# EAGLE board CFT-PB2-smd-revB (EAGLE 5.11), part 1 of 2
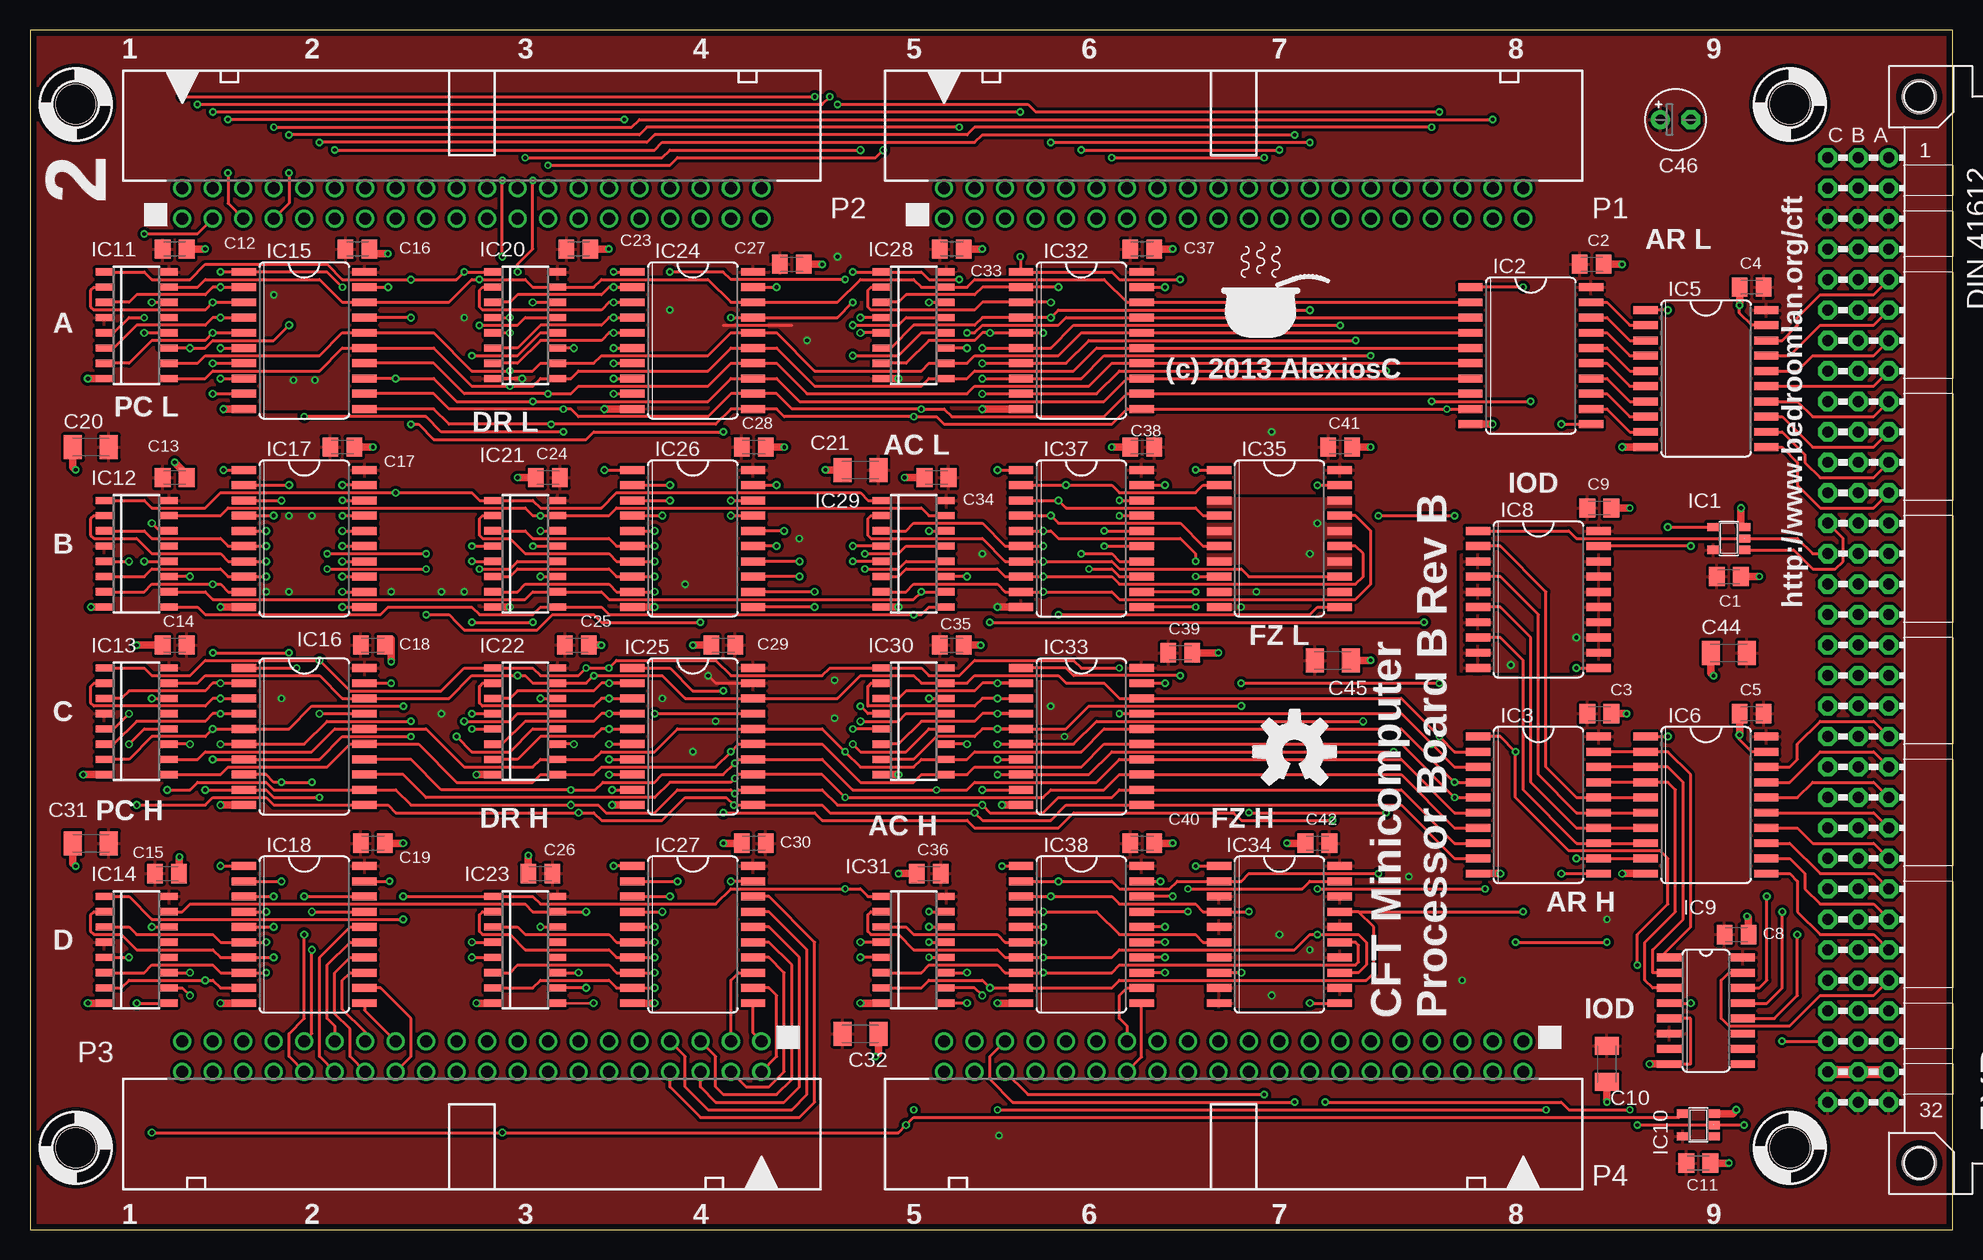
[diagram p6: board, top side]
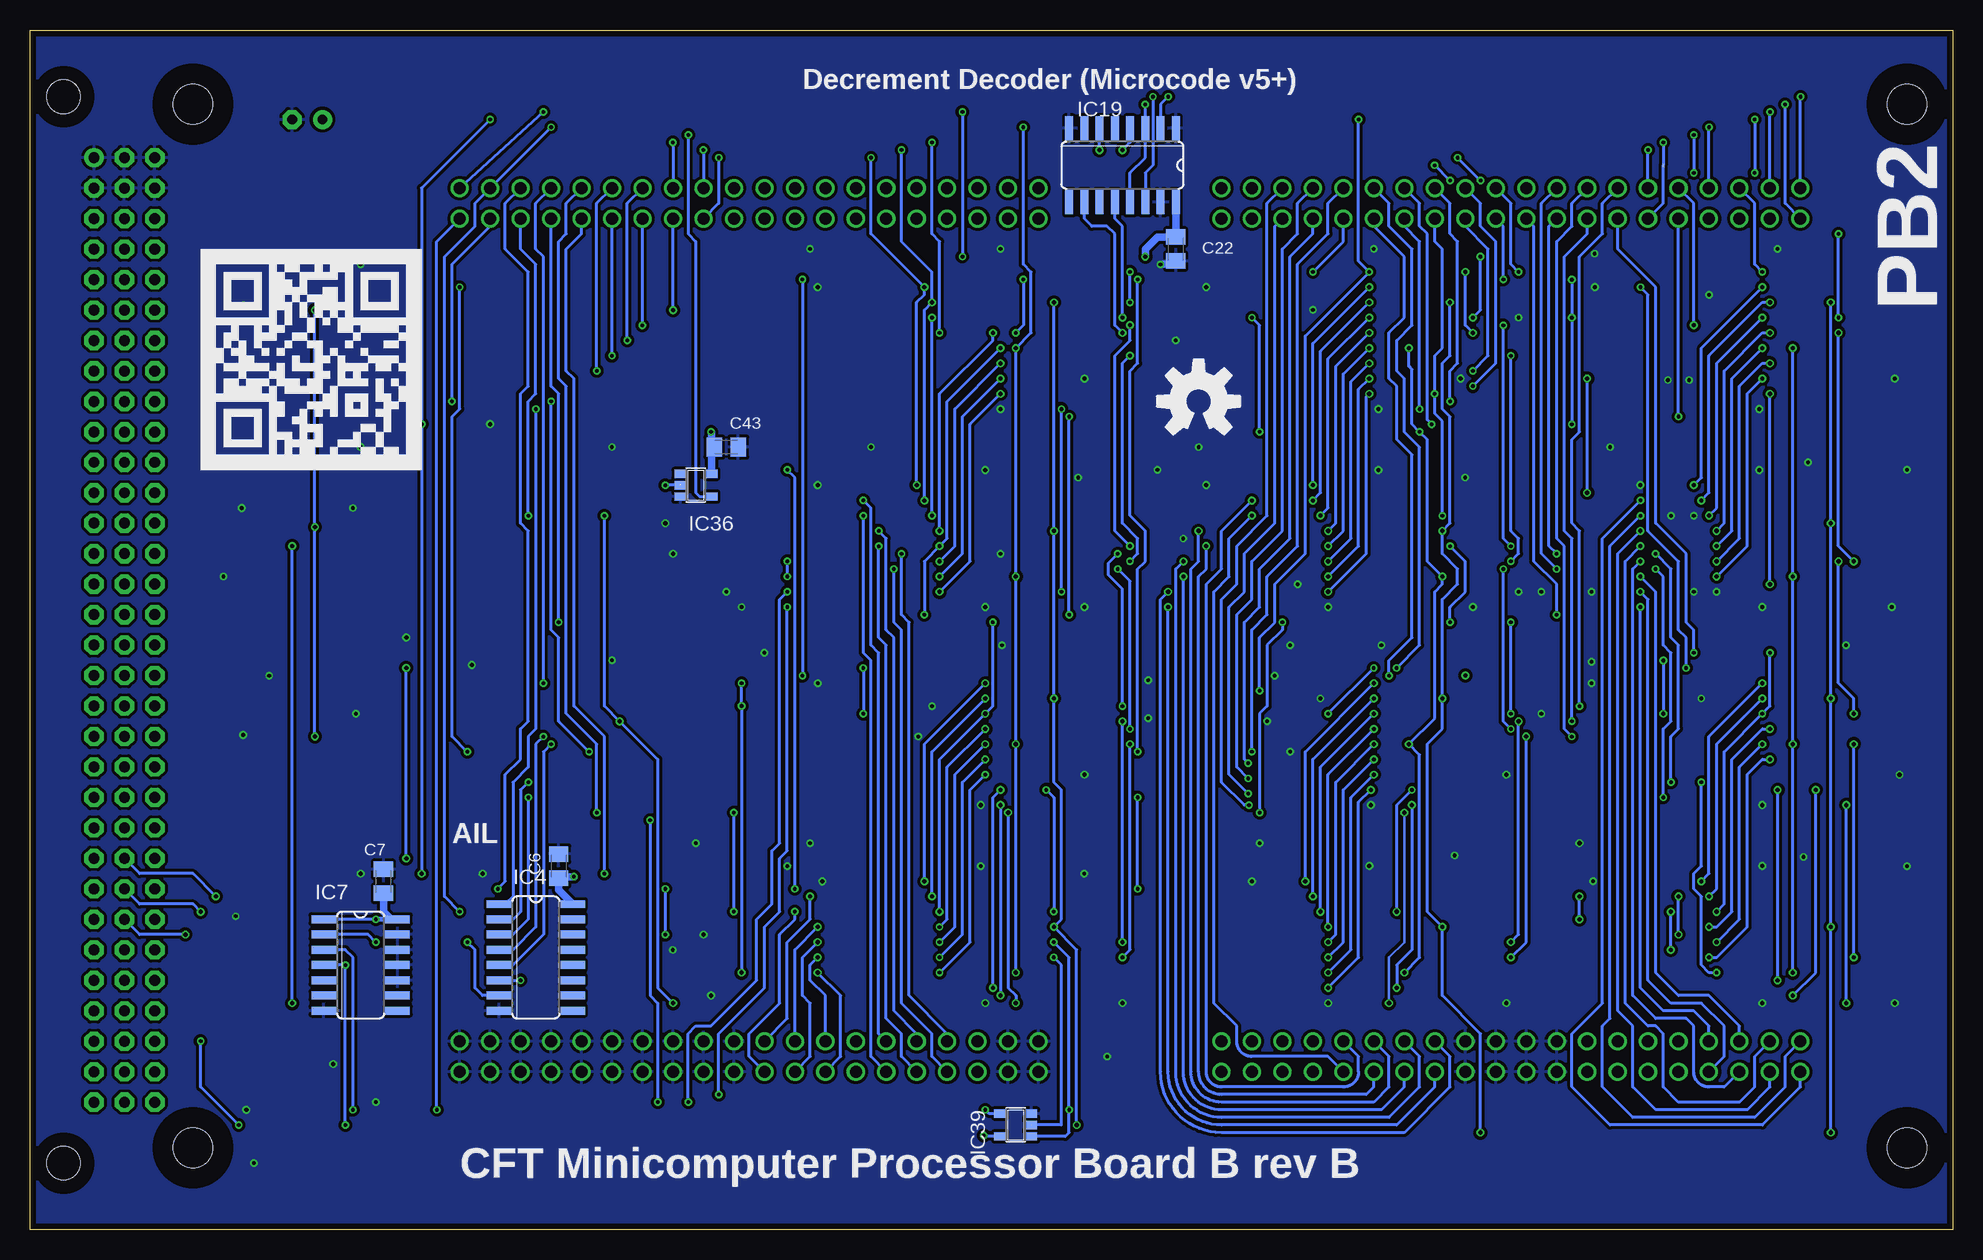
[diagram p7: board, bottom side, seen from below]

Size 160.27 x 100.03 mm. Coordinates in mm from the lower left corner, seen from the top.
Copper layers (1*16): Top 0.035mm / dielectric 1.5mm / Bottom 0.035mm
Design rules "smart-prototyping *": minimum track width 7mil, minimum drill 12mil, track to track 7mil, track to pad 7mil, pad to pad 7mil, via to via 7mil, smd to smd 0mil, copper to edge 20mil, drill to drill 10mil, minimum pad ring 10mil, minimum via ring 6mil, stop-mask expansion 2mil, vias tented up to drill 25mil, thermal gap 10mil
Net classes: 0 default: width 0.152 mm, clearance 0.152 mm; 1 low power: width 0.305 mm, clearance 0.152 mm; 2 LED power: width 0.406 mm, clearance 0.254 mm

## Footprints (pad centres in the part's own frame; a part is rotated, then mirrored left to right if it is on the bottom)
C0805K = smd 1.3 x 1.6: 1 -1,0; 2 1,0
C1206K = smd 1.5 x 2: 1 -1.5,0; 2 1.5,0
E2,5-5 = drill 0.813 pad 1.6 round: + -1.27,0 | drill 0.813 pad 1.6 octagon: - 1.27,0
VG96K = drill 0.914 pad 1.6 round: A1 154.94,39.37 | drill 0.914 pad 1.6 octagon: A2 154.94,36.83; A3 154.94,34.29; A4 154.94,31.75; A5 154.94,29.21; A6 154.94,26.67; A7 154.94,24.13; A8 154.94,21.59; A9 154.94,19.05; A10 154.94,16.51; A11 154.94,13.97; A12 154.94,11.43; A13 154.94,8.89; A14 154.94,6.35; A15 154.94,3.81; A16 154.94,1.27; A17 154.94,-1.27; A18 154.94,-3.81; A19 154.94,-6.35; A20 154.94,-8.89; A21 154.94,-11.43; A22 154.94,-13.97; A23 154.94,-16.51; A24 154.94,-19.05; A25 154.94,-21.59; A26 154.94,-24.13; A27 154.94,-26.67; A28 154.94,-29.21; A29 154.94,-31.75; A30 154.94,-34.29; A31 154.94,-36.83; A32 154.94,-39.37; B1 152.4,39.37; B2 152.4,36.83; B3 152.4,34.29; B4 152.4,31.75; B5 152.4,29.21; B6 152.4,26.67; B7 152.4,24.13; B8 152.4,21.59; B9 152.4,19.05; B10 152.4,16.51; B11 152.4,13.97; B12 152.4,11.43; B13 152.4,8.89; B14 152.4,6.35; B15 152.4,3.81; B16 152.4,1.27; B17 152.4,-1.27; B18 152.4,-3.81; B19 152.4,-6.35; B20 152.4,-8.89; B21 152.4,-11.43; B22 152.4,-13.97; B23 152.4,-16.51; B24 152.4,-19.05; B25 152.4,-21.59; B26 152.4,-24.13; B27 152.4,-26.67; B28 152.4,-29.21; B29 152.4,-31.75; B30 152.4,-34.29; B31 152.4,-36.83; B32 152.4,-39.37; C1 149.86,39.37; C2 149.86,36.83; C3 149.86,34.29; C4 149.86,31.75; C5 149.86,29.21; C6 149.86,26.67; C7 149.86,24.13; C8 149.86,21.59; C9 149.86,19.05; C10 149.86,16.51; C11 149.86,13.97; C12 149.86,11.43; C13 149.86,8.89; C14 149.86,6.35; C15 149.86,3.81; C16 149.86,1.27; C17 149.86,-1.27; C18 149.86,-3.81; C19 149.86,-6.35; C20 149.86,-8.89; C21 149.86,-11.43; C22 149.86,-13.97; C23 149.86,-16.51; C24 149.86,-19.05; C25 149.86,-21.59; C26 149.86,-24.13; C27 149.86,-26.67; C28 149.86,-29.21; C29 149.86,-31.75; C30 149.86,-34.29; C31 149.86,-36.83; C32 149.86,-39.37 | hole 2.794: 157.48,44.45; 157.48,-44.45
SOT23-5 = smd 0.69 x 0.99: 1 -0.95,-1.29; 2 0,-1.29; 3 0.95,-1.29; 4 0.95,1.3; 5 -0.95,1.3
SO20W = smd 0.66 x 2.032: 1 -5.715,-5.029; 2 -4.445,-5.029; 3 -3.175,-5.029; 4 -1.905,-5.029; 5 -0.635,-5.029; 6 0.635,-5.029; 7 1.905,-5.029; 8 3.175,-5.029; 9 4.445,-5.029; 10 5.715,-5.029; 11 5.715,5.029; 12 4.445,5.029; 13 3.175,5.029; 14 1.905,5.029; 15 0.635,5.029; 16 -0.635,5.029; 17 -1.905,5.029; 18 -3.175,5.029; 19 -4.445,5.029; 20 -5.715,5.029
SO16 = smd 0.66 x 2.032: 1 -4.445,-3.073; 2 -3.175,-3.073; 3 -1.905,-3.073; 4 -0.635,-3.073; 5 0.635,-3.073; 6 1.905,-3.073; 7 3.175,-3.073; 8 4.445,-3.073; 9 4.445,3.073; 10 3.175,3.073; 11 1.905,3.073; 12 0.635,3.073; 13 -0.635,3.073; 14 -1.905,3.073; 15 -3.175,3.073; 16 -4.445,3.073
SO14 = smd 0.66 x 2.032: 1 -3.81,-3.073; 2 -2.54,-3.073; 3 -1.27,-3.073; 4 0,-3.073; 5 1.27,-3.073; 6 2.54,-3.073; 7 3.81,-3.073; 8 3.81,3.073; 9 2.54,3.073; 10 1.27,3.073; 11 0,3.073; 12 -1.27,3.073; 13 -2.54,3.073; 14 -3.81,3.073
SO16D = smd 0.6 x 1.4: 1 -4.445,-2.715; 2 -3.175,-2.715; 3 -1.905,-2.715; 4 -0.635,-2.715; 5 0.635,-2.715; 6 1.905,-2.715; 7 3.175,-2.715; 8 4.445,-2.715; 9 4.445,2.715; 10 3.175,2.715; 11 1.905,2.715; 12 0.635,2.715; 13 -0.635,2.715; 14 -1.905,2.715; 15 -3.175,2.715; 16 -4.445,2.715
PAK100/2500-5-40 = drill 1 pad 1.422 round: 1 -24.13,-1.27; 2 -24.13,1.27; 3 -21.59,-1.27; 4 -21.59,1.27; 5 -19.05,-1.27; 6 -19.05,1.27; 7 -16.51,-1.27; 8 -16.51,1.27; 9 -13.97,-1.27; 10 -13.97,1.27; 11 -11.43,-1.27; 12 -11.43,1.27; 13 -8.89,-1.27; 14 -8.89,1.27; 15 -6.35,-1.27; 16 -6.35,1.27; 17 -3.81,-1.27; 18 -3.81,1.27; 19 -1.27,-1.27; 20 -1.27,1.27; 21 1.27,-1.27; 22 1.27,1.27; 23 3.81,-1.27; 24 3.81,1.27; 25 6.35,-1.27; 26 6.35,1.27; 27 8.89,-1.27; 28 8.89,1.27; 29 11.43,-1.27; 30 11.43,1.27; 31 13.97,-1.27; 32 13.97,1.27; 33 16.51,-1.27; 34 16.51,1.27; 35 19.05,-1.27; 36 19.05,1.27; 37 21.59,-1.27; 38 21.59,1.27; 39 24.13,-1.27; 40 24.13,1.27
STANDOFF_28_60 = hole 3.302: 0,0
SIGNAL-RENAME = smd 0.305 x 0.152: P$1 0,0; P$2 0,0

## Placement (x,y rotation side)
$4_37_$  SIGNATURESILK  [SIGNATURE]  99.69,74.14 0 top
$4_39_$  OSHW-LOGOL  [OSHW-LOGO-L]  105.41,39.85 0 top
$4_39_$1  OSHW-LOGOL  [OSHW-LOGO-L]  62.87,69.06 0 bottom
$4_40_$  QRCODE-CFT  [CFT-QRCODE]  146.05,63.35 0 bottom
C1  0.1uF  [C0805K]  141.6,54.46 180 top
C2  0.1uF  [C0805K]  130.18,80.49 180 top
C3  0.1uF  [C0805K]  130.81,43.03 180 top
C4  0.1uF  [C0805K]  143.51,78.59 0 top
C5  0.1uF  [C0805K]  143.51,43.03 0 top
C6  0.1uF  [C0805K]  116.2,30.33 270 bottom
C7  0.1uF  [C0805K]  130.81,29.06 270 bottom
C8  0.1uF  [C0805K]  142.24,24.61 180 top
C9  0.1uF  [C0805K]  130.81,60.17 180 top
C10  1uF  [C1206K]  131.44,13.82 90 top
C11  0.1uF  [C0805K]  139.06,5.56 180 top
C12  0.1uF  [C0805K]  12.06,81.76 180 top
C13  0.1uF  [C0805K]  12.06,62.71 180 top
C14  0.1uF  [C0805K]  12.06,48.74 0 top
C15  0.1uF  [C0805K]  11.43,29.69 180 top
C16  0.1uF  [C0805K]  27.3,81.76 180 top
C17  0.1uF  [C0805K]  26.04,65.25 180 top
C18  0.1uF  [C0805K]  28.57,48.74 180 top
C19  0.1uF  [C0805K]  28.57,32.23 0 top
C20  1uF  [C1206K]  5.08,65.25 0 top
C21  1uF  [C1206K]  69.22,63.35 0 top
C22  0.1uF  [C0805K]  64.77,81.76 90 bottom
C23  0.1uF  [C0805K]  45.72,81.76 180 top
C24  0.1uF  [C0805K]  43.18,62.71 0 top
C25  0.1uF  [C0805K]  45.59,48.74 180 top
C26  0.1uF  [C0805K]  42.55,29.69 0 top
C27  0.1uF  [C0805K]  63.5,80.49 180 top
C28  0.1uF  [C0805K]  60.33,65.25 180 top
C29  0.1uF  [C0805K]  57.78,48.74 0 top
C30  0.1uF  [C0805K]  60.33,32.23 180 top
C31  1uF  [C1206K]  5.08,32.23 0 top
C32  1uF  [C1206K]  69.22,16.36 180 top
C33  0.1uF  [C0805K]  76.83,81.76 180 top
C34  0.1uF  [C0805K]  75.56,62.71 0 top
C35  0.1uF  [C0805K]  76.83,48.74 180 top
C36  0.1uF  [C0805K]  74.93,29.69 0 top
C37  0.1uF  [C0805K]  92.71,81.76 180 top
C38  0.1uF  [C0805K]  92.71,65.25 0 top
C39  0.1uF  [C0805K]  95.89,48.11 180 top
C40  0.1uF  [C0805K]  92.71,32.23 180 top
C41  0.1uF  [C0805K]  109.22,65.25 180 top
C42  0.1uF  [C0805K]  107.31,32.23 0 top
C43  0.1uF  [C0805K]  102.23,65.25 0 bottom
C44  1uF  [C1206K]  141.6,48.11 0 top
C45  1uF  [C1206K]  108.58,47.47 180 top
C46  1uF  [E2,5-5]  137.16,92.56 0 top
EXP  [VG96K]  0,50.01 0 top
IC1  74AHC1G08DBV  [SOT23-5]  141.6,57.63 90 top
IC2  74HC574D  [SO20W]  125.09,72.87 270 top
IC3  74HC574D  [SO20W]  125.73,35.41 270 top
IC4  74HC138D  [SO16]  118.11,22.71 270 bottom
IC5  74HC541DW  [SO20W]  139.7,70.97 270 top
IC6  74HC541DW  [SO20W]  139.7,35.41 270 top
IC7  74HC74D  [SO14]  132.72,22.07 270 bottom
IC8  74HC688DW  [SO20W]  125.73,52.55 270 top
IC9  74HC138D  [SO16]  139.7,18.26 270 top
IC10  74AHC1G04DBV  [SOT23-5]  139.06,8.74 90 top
IC11  74HC193D  [SO16D]  8.89,75.41 270 top
IC12  74HC193D  [SO16D]  8.89,56.36 270 top
IC13  74HC193D  [SO16D]  8.89,42.39 270 top
IC14  74HC193D  [SO16D]  8.89,23.34 270 top
IC15  74HC541DW  [SO20W]  22.86,74.14 270 top
IC16  74HC541DW  [SO20W]  22.86,41.12 270 top
IC17  74HC541DW  [SO20W]  22.86,57.63 270 top
IC18  74HC541DW  [SO20W]  22.86,24.61 270 top
IC19  74HC139D  [SO16]  69.22,88.75 180 bottom
IC20  74HC193D  [SO16D]  41.27,75.41 270 top
IC21  74HC193D  [SO16D]  41.27,56.36 270 top
IC22  74HC193D  [SO16D]  41.27,42.39 270 top
IC23  74HC193D  [SO16D]  41.27,23.34 270 top
IC24  74HC541DW  [SO20W]  55.24,74.14 270 top
IC25  74HC541DW  [SO20W]  55.24,41.12 270 top
IC26  74HC541DW  [SO20W]  55.24,57.63 270 top
IC27  74HC541DW  [SO20W]  55.24,24.61 270 top
IC28  74HC193D  [SO16D]  73.66,75.41 270 top
IC29  74HC193D  [SO16D]  73.66,56.36 270 top
IC30  74HC193D  [SO16D]  73.66,42.39 270 top
IC31  74HC193D  [SO16D]  73.66,23.34 270 top
IC32  74HC541DW  [SO20W]  87.63,74.14 270 top
IC33  74HC541DW  [SO20W]  87.63,41.12 270 top
IC34  74HC688DW  [SO20W]  104.14,24.61 270 top
IC35  74HC688DW  [SO20W]  104.14,57.63 270 top
IC36  74AHC1G04DBV  [SOT23-5]  104.78,62.08 270 bottom
IC37  74HC541DW  [SO20W]  87.63,57.63 270 top
IC38  74HC541DW  [SO20W]  87.63,24.61 270 top
IC39  74AHC1G08DBV  [SOT23-5]  78.11,8.74 90 bottom
P1  2540-5  [PAK100/2500-5-40]  100.33,85.57 0 top
P2  2540-5  [PAK100/2500-5-40]  36.83,85.57 0 top
P3  2540-5  [PAK100/2500-5-40]  36.83,14.45 180 top
P4  2540-5  [PAK100/2500-5-40]  100.33,14.45 180 top
U1  HOLE  [STANDOFF_28_60]  3.81,93.83 0 top
U2  HOLE  [STANDOFF_28_60]  3.81,6.83 0 top
U3  HOLE  [STANDOFF_28_60]  146.69,6.83 0 top
U4  HOLE  [STANDOFF_28_60]  146.69,93.83 0 top
X1  SIGNAL-RENAME  [SIGNAL-RENAME]  24.13,88.75 270 bottom